# EAGLE design RFDuino breakout (EAGLE 6.3)
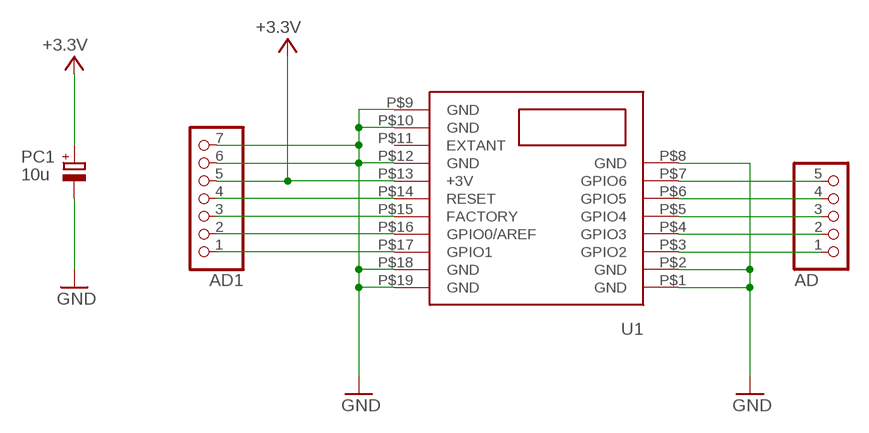
[diagram p0: schematic, sheet 1]

## Parts
AD  PINHD-1X5  [1X05]
AD1  PINHD-1X7  [1X07]
PC1  10u  CPOL-EUD  [PANASONIC_D]
U1  RFD22301  [RFD22301]

## Nets
3.3V: AD1.5 PC1.+ U1.P$13(+3V) ; supply symbol labelled +3.3V
FACTORY: AD1.3 U1.P$15(FACTORY)
GND: AD1.6 AD1.7 PC1.- U1.P$1(GND) U1.P$2(GND) U1.P$8(GND) U1.P$9(GND) U1.P$10(GND) U1.P$12(GND) U1.P$18(GND) U1.P$19(GND)
GPIO0: AD1.2 U1.P$16(GPIO0/AREF)
GPIO1: AD1.1 U1.P$17(GPIO1)
GPIO2: AD.1 U1.P$3(GPIO2)
GPIO3: AD.2 U1.P$4(GPIO3)
GPIO4: AD.3 U1.P$5(GPIO4)
GPIO5: AD.4 U1.P$6(GPIO5)
GPIO6: AD.5 U1.P$7(GPIO6)
RESET: AD1.4 U1.P$14(RESET)
Unconnected: U1.P$11(EXTANT)

## Library data of the parts
AD = pinhead:PINHD-1X5: PIN HEADER
AD1 = pinhead:PINHD-1X7: PIN HEADER
PC1 = rcl:CPOL-EU: POLARIZED CAPACITOR, European symbol
U1 = RFDuino:RFD22301

## Net classes
0 default: width 0.152 mm, clearance 0.152 mm
2 gnd: width 0.203 mm, drill 0.559 mm, clearance 0.152 mm
3 usbvcc: width 0.203 mm, drill 0.61 mm, clearance 0.152 mm

## Board
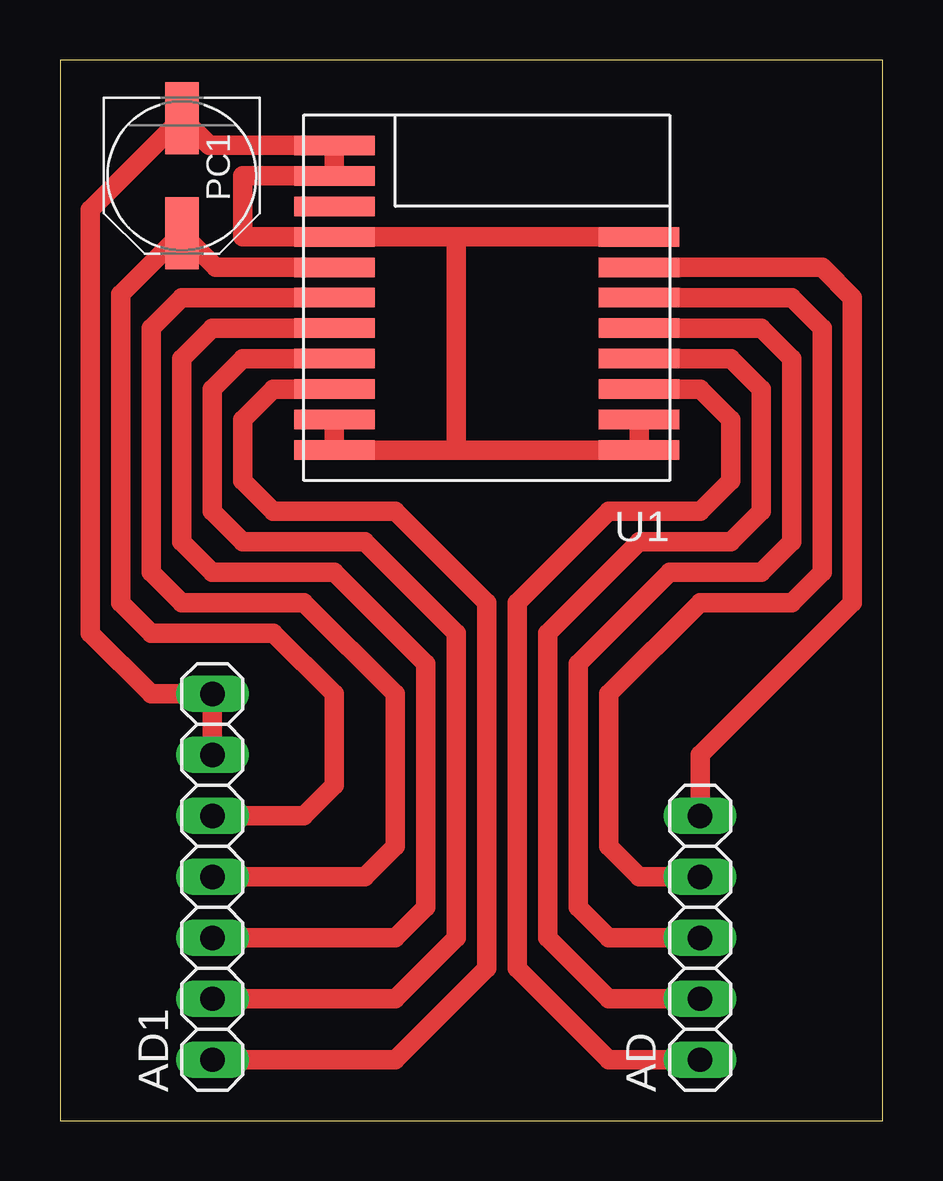
[diagram p1: board, top side]

Size 34.29 x 44.2 mm. Coordinates in mm from the lower left corner, seen from the top.
Outline: 0,0 34.29,0 34.29,44.2 0,44.2 0,0
Copper layers (1*16): Top 0.035mm / dielectric 1.5mm / Bottom 0.035mm
Design rules "default": minimum track width 10mil, minimum drill 24mil, track to track 8mil, track to pad 8mil, pad to pad 8mil, via to via 8mil, smd to smd 8mil, copper to edge 40mil, drill to drill 8mil, minimum pad ring 10mil, minimum via ring 8mil, stop-mask expansion 4mil, vias tented up to drill 0mil, thermal gap 10mil

### Footprints (pad centres in the part's own frame; a part is rotated, then mirrored left to right if it is on the bottom)
1X05 = drill 1.016 long: 1 -5.08,0; 2 -2.54,0; 3 0,0; 4 2.54,0; 5 5.08,0
1X07 = drill 1.016 long: 1 -7.62,0; 2 -5.08,0; 3 -2.54,0; 4 0,0; 5 2.54,0; 6 5.08,0; 7 7.62,0
PANASONIC_D = smd 3 x 1.4: + 2.4,0; - -2.4,0
RFD22301 = smd 3.353 x 0.813: P$1 -6.35,6.35; P$2 -6.35,5.08; P$3 -6.35,3.81; P$4 -6.35,2.54; P$5 -6.35,1.27; P$6 -6.35,0; P$7 -6.35,-1.27; P$8 -6.35,-2.54; P$9 6.35,-6.35; P$10 6.35,-5.08; P$11 6.35,-3.81; P$12 6.35,-2.54; P$13 6.35,-1.27; P$14 6.35,0; P$15 6.35,1.27; P$16 6.35,2.54; P$17 6.35,3.81; P$18 6.35,5.08; P$19 6.35,6.35

### Placement (x,y rotation side)
AD  26.67,7.62 90 top
AD1  6.35,10.16 90 top
PC1  5.08,39.37 270 top
U1  17.78,34.29 180 top

### Tracks (layer width: path | path; a pad name or v marks a point on that pad's centre or on a via)
3.3V
  Top 0.813: AD1.5 10.16,12.7 11.43,13.97 11.43,17.78 8.89,20.32 3.81,20.32 2.54,21.59 2.54,34.43 PC1.+ 6.49,35.56 U1.P$13
FACTORY
  Top 0.813: AD1.3 13.97,7.62 15.24,8.89 15.24,19.05 11.43,22.86 6.35,22.86 5.08,24.13 5.08,31.75 6.35,33.02 U1.P$15
GND
  Top 0.813: U1.P$2 U1.P$1 16.51,27.94 | AD1.6 AD1.7 3.81,17.78 1.27,20.32 1.27,37.96 PC1.- 6.21,40.64 U1.P$9 U1.P$10 7.62,39.37 7.62,36.83 U1.P$12 | U1.P$12 U1.P$8 | 16.51,27.94 U1.P$19 U1.P$18 | U1.P$12 16.51,36.83 16.51,27.94
GPIO0
  Top 0.813: AD1.2 13.97,5.08 16.51,7.62 16.51,20.32 12.7,24.13 7.62,24.13 6.35,25.4 6.35,30.48 7.62,31.75 U1.P$16
GPIO1
  Top 0.813: AD1.1 13.97,2.54 17.78,6.35 17.78,21.59 13.97,25.4 8.89,25.4 7.62,26.67 7.62,29.21 8.89,30.48 U1.P$17
GPIO2
  Top 0.813: AD.1 22.86,2.54 19.05,6.35 19.05,21.59 22.86,25.4 26.67,25.4 27.94,26.67 27.94,29.21 26.67,30.48 U1.P$3
GPIO3
  Top 0.813: AD.2 22.86,5.08 20.32,7.62 20.32,20.32 24.13,24.13 27.94,24.13 29.21,25.4 29.21,30.48 27.94,31.75 U1.P$4
GPIO4
  Top 0.813: AD.3 22.86,7.62 21.59,8.89 21.59,19.05 25.4,22.86 29.21,22.86 30.48,24.13 30.48,31.75 29.21,33.02 U1.P$5
GPIO5
  Top 0.813: AD.4 24.13,10.16 22.86,11.43 22.86,17.78 26.67,21.59 30.48,21.59 31.75,22.86 31.75,33.02 30.48,34.29 U1.P$6
GPIO6
  Top 0.813: AD.5 26.67,15.24 33.02,21.59 33.02,34.29 31.75,35.56 U1.P$7
RESET
  Top 0.813: AD1.4 12.7,10.16 13.97,11.43 13.97,17.78 10.16,21.59 5.08,21.59 3.81,22.86 3.81,33.02 5.08,34.29 U1.P$14